# Altium schematic sheet pfe.SchDoc: projet fin d'etude
size A4; Date: 05/03/2025; ApprovedBy: Jabnouni Maymoun; CheckedBy: Jabnouni Maymoun; CompanyName: STEG; DrawnBy: Jabnouni Maymoun; DocumentNumber: 1; Revision: 0; SheetNumber: 1; SheetTotal: 1; Time: 6:55
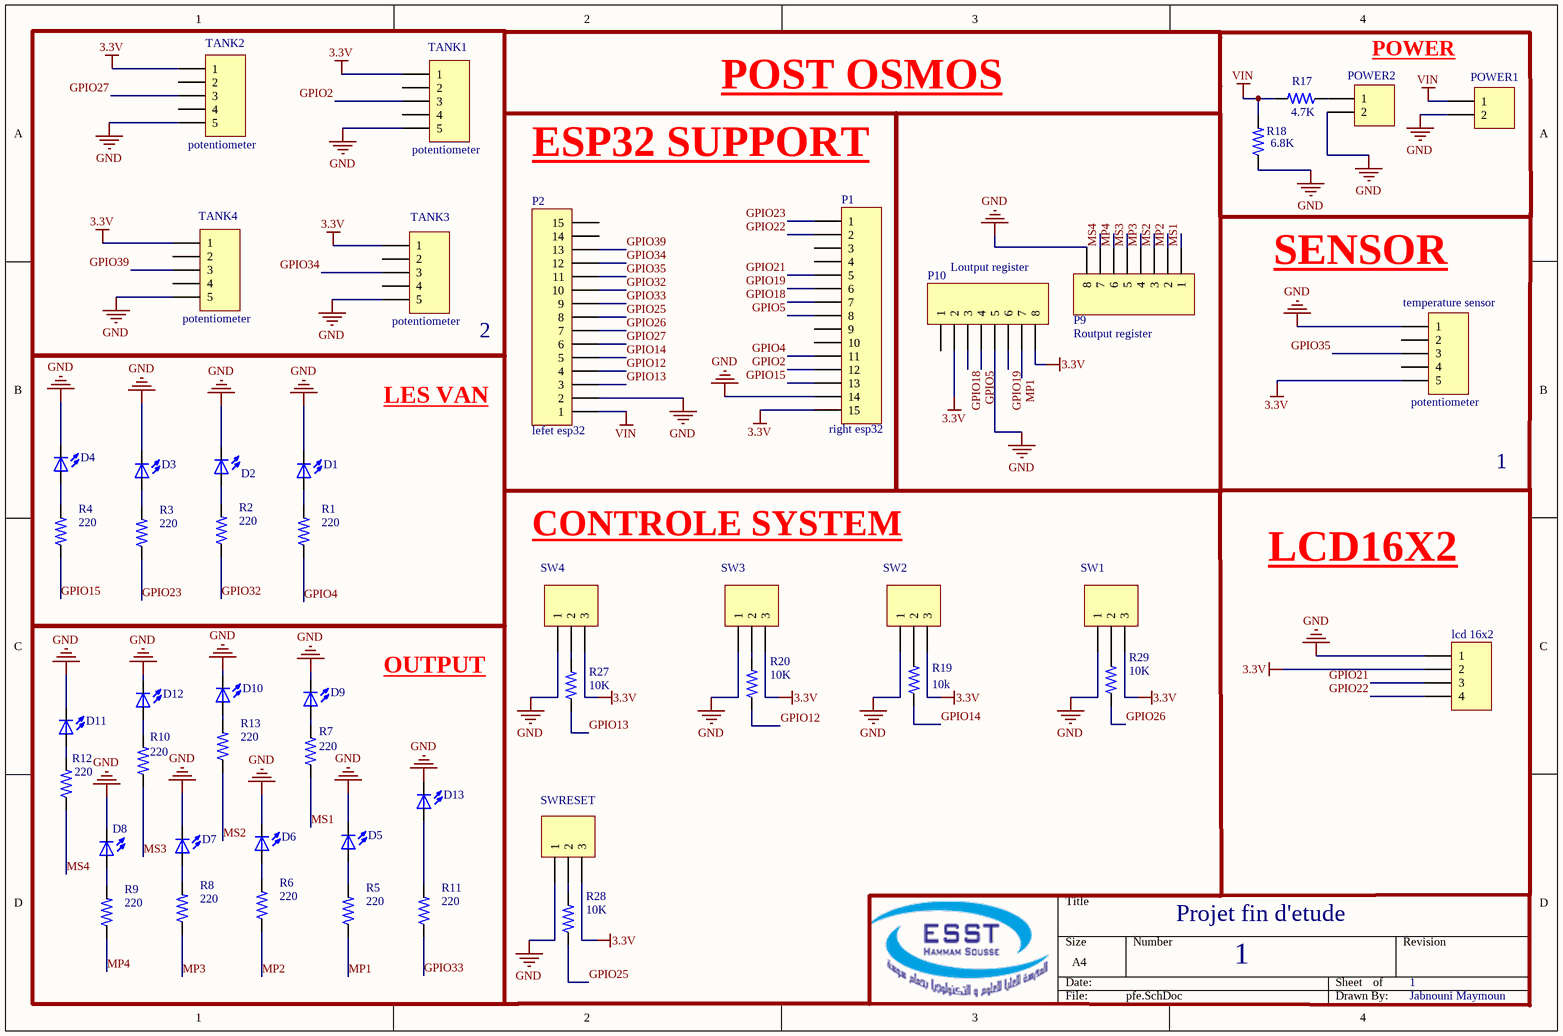
[diagram p0: pfe.SchDoc]

## Parts
D1  (no value)  [LED3MM]
D2  (no value)  [LED3MM]
D3  (no value)  [LED3MM]
D4  (no value)  [LED3MM]
D5  (no value)  [LED3MM]
D6  (no value)  [LED3MM]
D7  (no value)  [LED3MM]
D8  (no value)  [LED3MM]
D9  (no value)  [LED3MM]
D10  (no value)  [LED3MM]
D11  (no value)  [LED3MM]
D12  (no value)  [LED3MM]
D13  (no value)  [LED3MM]
lcd_16x2  lcd 16x2  [HDR1X4]  (value not drawn)
P1  right esp32  [HDR1X15]
P2  lefet esp32  [HDR1X15]
P9  Routput register  [HDR1X8]
P10  Loutput register  [HDR1X8]
POWER1  POWER1  [HDR1X2]  (value not drawn)
POWER2  POWER2  [HDR1X2]  (value not drawn)
R1  value 220  [RESAD640W45L370D200]  (hidden comment: 1622194-1)
R2  value 220  [RESAD640W45L370D200]  (hidden comment: 1622194-1)
R3  value 220  [RESAD640W45L370D200]  (hidden comment: 1622194-1)
R4  value 220  [RESAD640W45L370D200]  (hidden comment: 1622194-1)
R5  value 220  [RESAD640W45L370D200]  (hidden comment: 1622194-1)
R6  value 220  [RESAD640W45L370D200]  (hidden comment: 1622194-1)
R7  value 220  [RESAD640W45L370D200]  (hidden comment: 1622194-1)
R8  value 220  [RESAD640W45L370D200]  (hidden comment: 1622194-1)
R9  value 220  [RESAD640W45L370D200]  (hidden comment: 1622194-1)
R10  value 220  [RESAD640W45L370D200]  (hidden comment: 1622194-1)
R11  value 220  [RESAD640W45L370D200]  (hidden comment: 1622194-1)
R12  value 220  [RESAD640W45L370D200]  (hidden comment: 1622194-1)
R13  value 220  [RESAD640W45L370D200]  (hidden comment: 1622194-1)
R17  value 4.7K  [RESAD640W45L370D200]  (hidden comment: 1622194-1)
R18  value 6.8K  [RESAD640W45L370D200]  (hidden comment: 1622194-1)
R19  value 10k  [RESAD640W45L370D200]  (hidden comment: 1622194-1)
R20  value 10K  [RESAD640W45L370D200]  (hidden comment: 1622194-1)
R27  value 10K  [RESAD640W45L370D200]  (hidden comment: 1622194-1)
R28  value 10K  [RESAD640W45L370D200]  (hidden comment: 1622194-1)
R29  value 10K  [RESAD640W45L370D200]  (hidden comment: 1622194-1)
SW1  SW1  [HDR1X3]  (value not drawn)
SW2  SW2  [HDR1X3]  (value not drawn)
SW3  SW3  [HDR1X3]  (value not drawn)
SW4  SW4  [HDR1X3]  (value not drawn)
SWRESET  SWRESET  [HDR1X3]  (value not drawn)
TANK1  potentiometer  [HDR1X5]
TANK2  potentiometer  [HDR1X5]
TANK3  potentiometer  [HDR1X5]
TANK4  potentiometer  [HDR1X5]
temperature_sensor  potentiometer  [HDR1X5]

## Blocks framed on the sheet
2: TANK1-TANK4
SENSOR: temperature_sensor

## Nets
3.3V: lcd_16x2.2 P1.15 P10.2 P10.8 SW1.3 SW2.3 SW3.3 SW4.3 SWRESET.3 TANK1.1 TANK2.1 TANK3.1 TANK4.1 temperature_sensor.5
GND: D1.K(C) D2.K(C) D3.K(C) D4.K(C) D5.K(C) D6.K(C) D7.K(C) D8.K(C) D9.K(C) D10.K(C) D11.K(C) D12.K(C) D13.K(C) lcd_16x2.1 P1.14 P2.2 P9.8 P10.5 POWER1.2 POWER2.2 R18.1 SW1.1 SW2.1 SW3.1 SW4.1 SWRESET.1 TANK1.5 TANK2.5 TANK3.5 TANK4.5 temperature_sensor.1
VIN: P2.1 POWER1.1 R17.2 R18.2
GPIO2: P1.12 TANK1.3
GPIO4: P1.11 R1.1
GPIO5: P1.8 P10.4
GPIO12: P2.4 R20.1
GPIO13: P2.3 R27.1
GPIO14: P2.5 R19.1
GPIO15: P1.13 R4.1
GPIO18: P1.7 P10.3
GPIO19: P1.6 P10.6
GPIO21: lcd_16x2.3 P1.5
GPIO22: lcd_16x2.4 P1.2
GPIO23: P1.1 R3.1
GPIO25: P2.8 R28.1
GPIO26: P2.7 R29.1
GPIO27: P2.6 TANK2.3
GPIO32: P2.10 R2.1
GPIO33: P2.9 R11.1
GPIO34: P2.12 TANK3.3
GPIO35: P2.11 temperature_sensor.3
GPIO39: P2.13 TANK4.3
MP1: P10.7 R5.1
MP2: P9.2 R6.1
MP3: P9.4 R8.1
MP4: P9.6 R9.1
MS1: P9.1 R7.1
MS2: P9.3 R13.1
MS3: P9.5 R10.1
MS4: P9.7 R12.1
NetD1_A: D1.A R1.2
NetD2_A: D2.A R2.2
NetD3_A: D3.A R3.2
NetD4_A: D4.A R4.2
NetD5_A: D5.A R5.2
NetD6_A: D6.A R6.2
NetD7_A: D7.A R8.2
NetD8_A: D8.A R9.2
NetD9_A: D9.A R7.2
NetD10_A: D10.A R13.2
NetD11_A: D11.A R12.2
NetD12_A: D12.A R10.2
NetD13_A: D13.A R11.2
NetPOWER2_1: POWER2.1 R17.1
NetR19_2: R19.2 SW2.2
NetR20_2: R20.2 SW3.2
NetR27_2: R27.2 SW4.2
NetR28_2: R28.2 SWRESET.2
NetR29_2: R29.2 SW1.2

Not connected (* = marked no-connect by the designer): P1 3 4 9 10; P2 14 15; P10 1; TANK1 2 4; TANK2 2 4; TANK3 2 4; TANK4 2 4; temperature_sensor 2 4

## Notes on the sheet
- POST OSMOS
- POWER
- ESP32 SUPPORT
- LES VAN
- 1
- CONTROLE SYSTEM
- LCD16X2
- OUTPUT
- Projet fin d'etude
- Jabnouni Maymoun

## Library data of the parts
D1-D13 = TLLR4400: Red 619nm LED Indication - Discrete 1.9V Radial; MF: Vishay; Package: Radial Vishay Semiconductor; Value: *; Price: None; MP: TLLR4400; Availability: Unavailable; SnapEDA_Link: https://www.snapeda.com/parts/TLLR4400/Vishay%20Semiconductor%20Opto%20Division/view-part/557946/?ref=snap
lcd_16x2 = Header 4: Header, 4-Pin; LatestRevisionDate: 17-Jul-2002; LatestRevisionNote: Re-released for DXP Platform.; Publisher: Altium Limited
P1 P2 = Header 15: Header, 15-Pin; LatestRevisionDate: 17-Jul-2002; LatestRevisionNote: Re-released for DXP Platform.; Publisher: Altium Limited
P9 P10 = Header 8: Header, 8-Pin; LatestRevisionDate: 17-Jul-2002; LatestRevisionNote: Re-released for DXP Platform.; Publisher: Altium Limited
POWER1 POWER2 = Header 2: Header, 2-Pin; LatestRevisionDate: 17-Jul-2002; LatestRevisionNote: Re-released for DXP Platform.; Publisher: Altium Limited
R1-R13 R17-R20 R27-R29 = 1622194-1: LR0204 1% 220R; Package: None; Price: None; MP: 1622194-1; Availability: Unavailable
SW1-SW4 SWRESET = Header 3: Header, 3-Pin; LatestRevisionDate: 17-Jul-2002; LatestRevisionNote: Re-released for DXP Platform.; Publisher: Altium Limited
TANK1-TANK4 temperature_sensor = Header 5: Header, 5-Pin; LatestRevisionDate: 17-Jul-2002; LatestRevisionNote: Re-released for DXP Platform.; Publisher: Altium Limited